# Altium project Water_SmartV2.PrjPcb
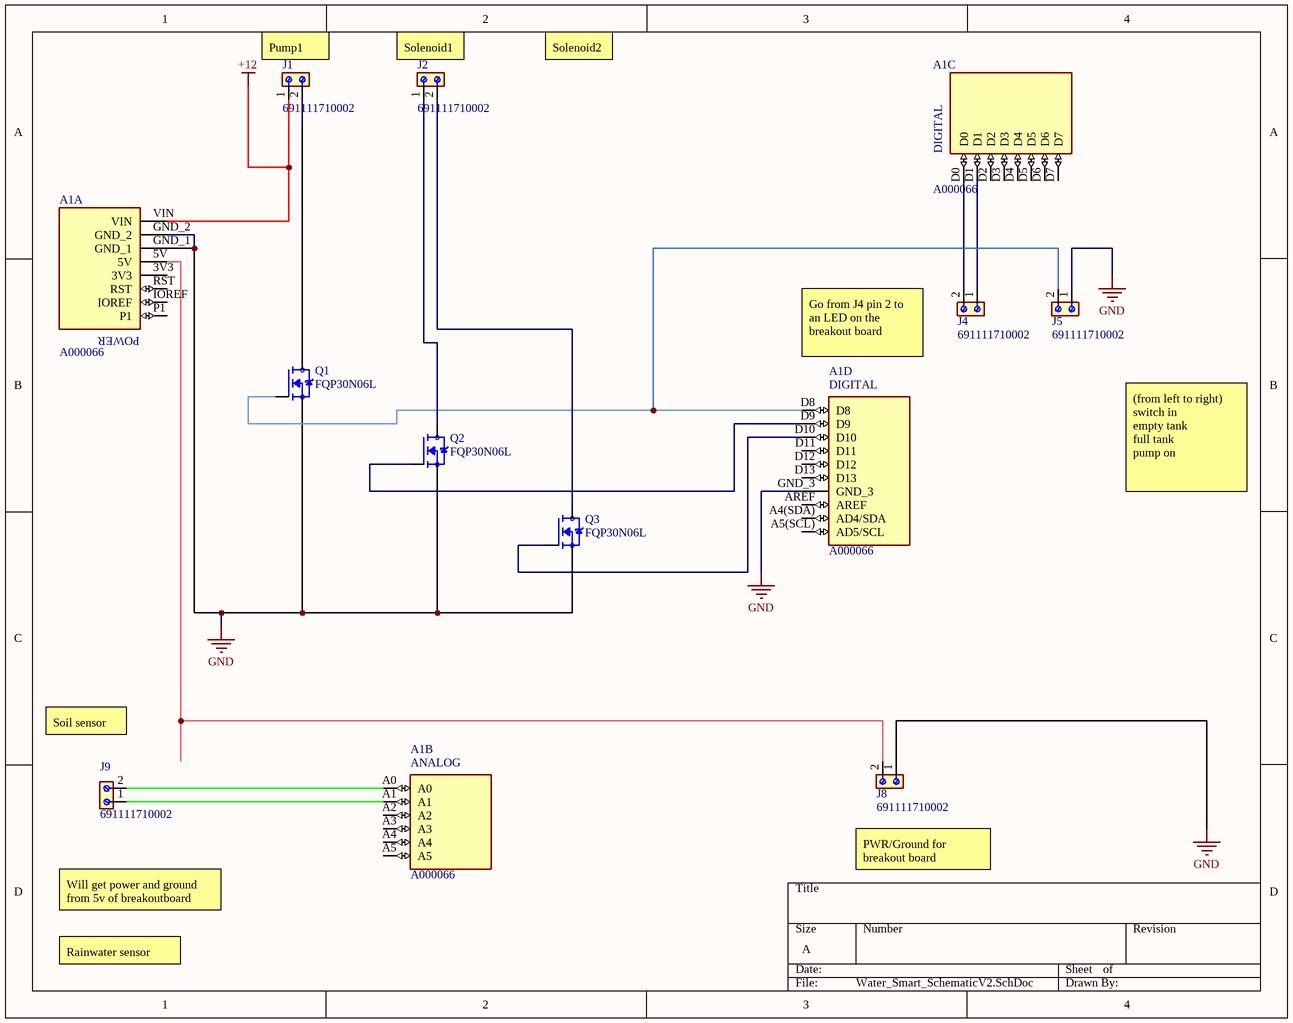
[diagram p0: Water_Smart_SchematicV2.SchDoc]
1 sheet, 10 parts. Net scope: global (net labels, ports and power ports of the same name join across sheets).
Board files: PCB1_t2.PcbDoc, PCB_T3.PcbDoc

## Sheet Water_Smart_SchematicV2.SchDoc
size A; SheetNumber: 1; SheetTotal: 1

### Parts
A1  A000066  [ARDUINO_A000066]  (parts A,B,C,D of 4)
J1  691111710002  [691111710002]
J2  691111710002  [691111710002]
J4  691111710002  [691111710002]
J5  691111710002  [691111710002]
J8  691111710002  [691111710002]
J9  691111710002  [691111710002]
Q1  FQP30N06L  [TO220V]
Q2  FQP30N06L  [TO220V]
Q3  FQP30N06L  [TO220V]

### Nets
+12: A1.VIN J1.1
GND: A1.GND_1 A1.GND_2 A1.GND_3 J5.1 J8.1 Q1.3(S) Q2.3(S) Q3.3(S)
NetA1_5V: A1.5V J8.2
NetA1_A0: A1.A0 J9.2
NetA1_A1: A1.A1 J9.1
NetA1_D0: A1.D0 J4.2
NetA1_D1: A1.D1 J4.1
NetA1_D8: A1.D8 J5.2 Q1.1(G)
NetA1_D9: A1.D9 Q2.1(G)
NetA1_D10: A1.D10 Q3.1(G)
NetJ1_2: J1.2 Q1.2(D)
NetJ2_1: J2.1 Q2.2(D)
NetJ2_2: J2.2 Q3.2(D)

Not connected (* = marked no-connect by the designer): A1 3V3 A2 A3 A4 A4(SDA)(AD4/SDA) A5 A5(SCL)(AD5/SCL) AREF D2 D3 D4 D5 D6 D7 D11 D12 D13 IOREF P1 RST

### Notes on the sheet
- (near J1) Pump1
- (near J2) Solenoid1
- Solenoid2
- Go from J4 pin 2 to an LED on the breakout board
- (from left to right)
  switch in
  empty tank
  full tank
  pump on
- Soil sensor
- Will get power and ground from 5v of breakoutboard
- PWR/Ground for breakout board
- Rainwater sensor
- (in symbol A000066, part A) POWER
- (in symbol A000066, part B) ANALOG
- (in symbol A000066, part C) DIGITAL
- (in symbol A000066, part D) DIGITAL

### Library data of the parts
A1 = A000066: Microcontroller board based on the ATmega328P.; pin to pad: A4(SDA)>A4(SDA; MF: Arduino; MP: Arduino Uno Rev3; Value: *; SnapEDA_Link: https://www.snapeda.com/parts/Arduino%20Uno%20Rev3/Arduino/view-part/?ref=snap; Availability: Not in stock; Price: None; Package: Non-Standard Arduino; Check_prices: https://www.snapeda.com/parts/Arduino%20Uno%20Rev3/Arduino/view-part/?ref=eda
J1 J2 J4 J5 J8 J9 = 691111710002: 2 Position Wire to Board Terminal Block Horizontal with Board 0.197 (5.00mm) Through Hole; MF: Wurth Electronics; SnapEDA_Link: https://www.snapeda.com/parts/691111710002/Wurth+Electronics+Inc./view-part/?ref=snap; Package: None; Value: *; MP: 691111710002; Check_prices: https://www.snapeda.com/parts/691111710002/Wurth+Electronics+Inc./view-part/?ref=eda
Q1-Q3 = FQP30N06L: N-Channel 60V 32A _Tc_ 79W _Tc_ Through Hole TO-220-3; MF: ON Semiconductor; Package: TO-220 ON Semiconductor; Price: None; Availability: Unavailable; MP: FQP30N06L; SnapEDA_Link: https://www.snapeda.com/parts/FQP30N06L/ON%20Semiconductor/view-part/1413126/?ref=snap; Value: *